# Altium schematic sheet Coil Board - Cover.SchDoc
size B
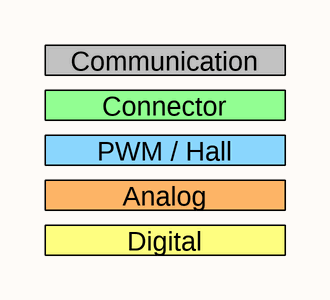
[diagram p0: Coil Board - Cover.SchDoc]

## Notes on the sheet
- Connector
- Communication
- PWM / Hall
- Analog
- Digital
- Title
- Size:
- Date:
- B
- Number:
- Time:
- Revision:
- Sheet
- of
- File: